# EasyEDA schematic 1-Schematic_SillyILO-0.0.1.json
TITLE: Sheet_1; REV: 1.0; Date: 2021-01-09; Sheet: 1/1; Drawn By: yaleman; Company: Your Company
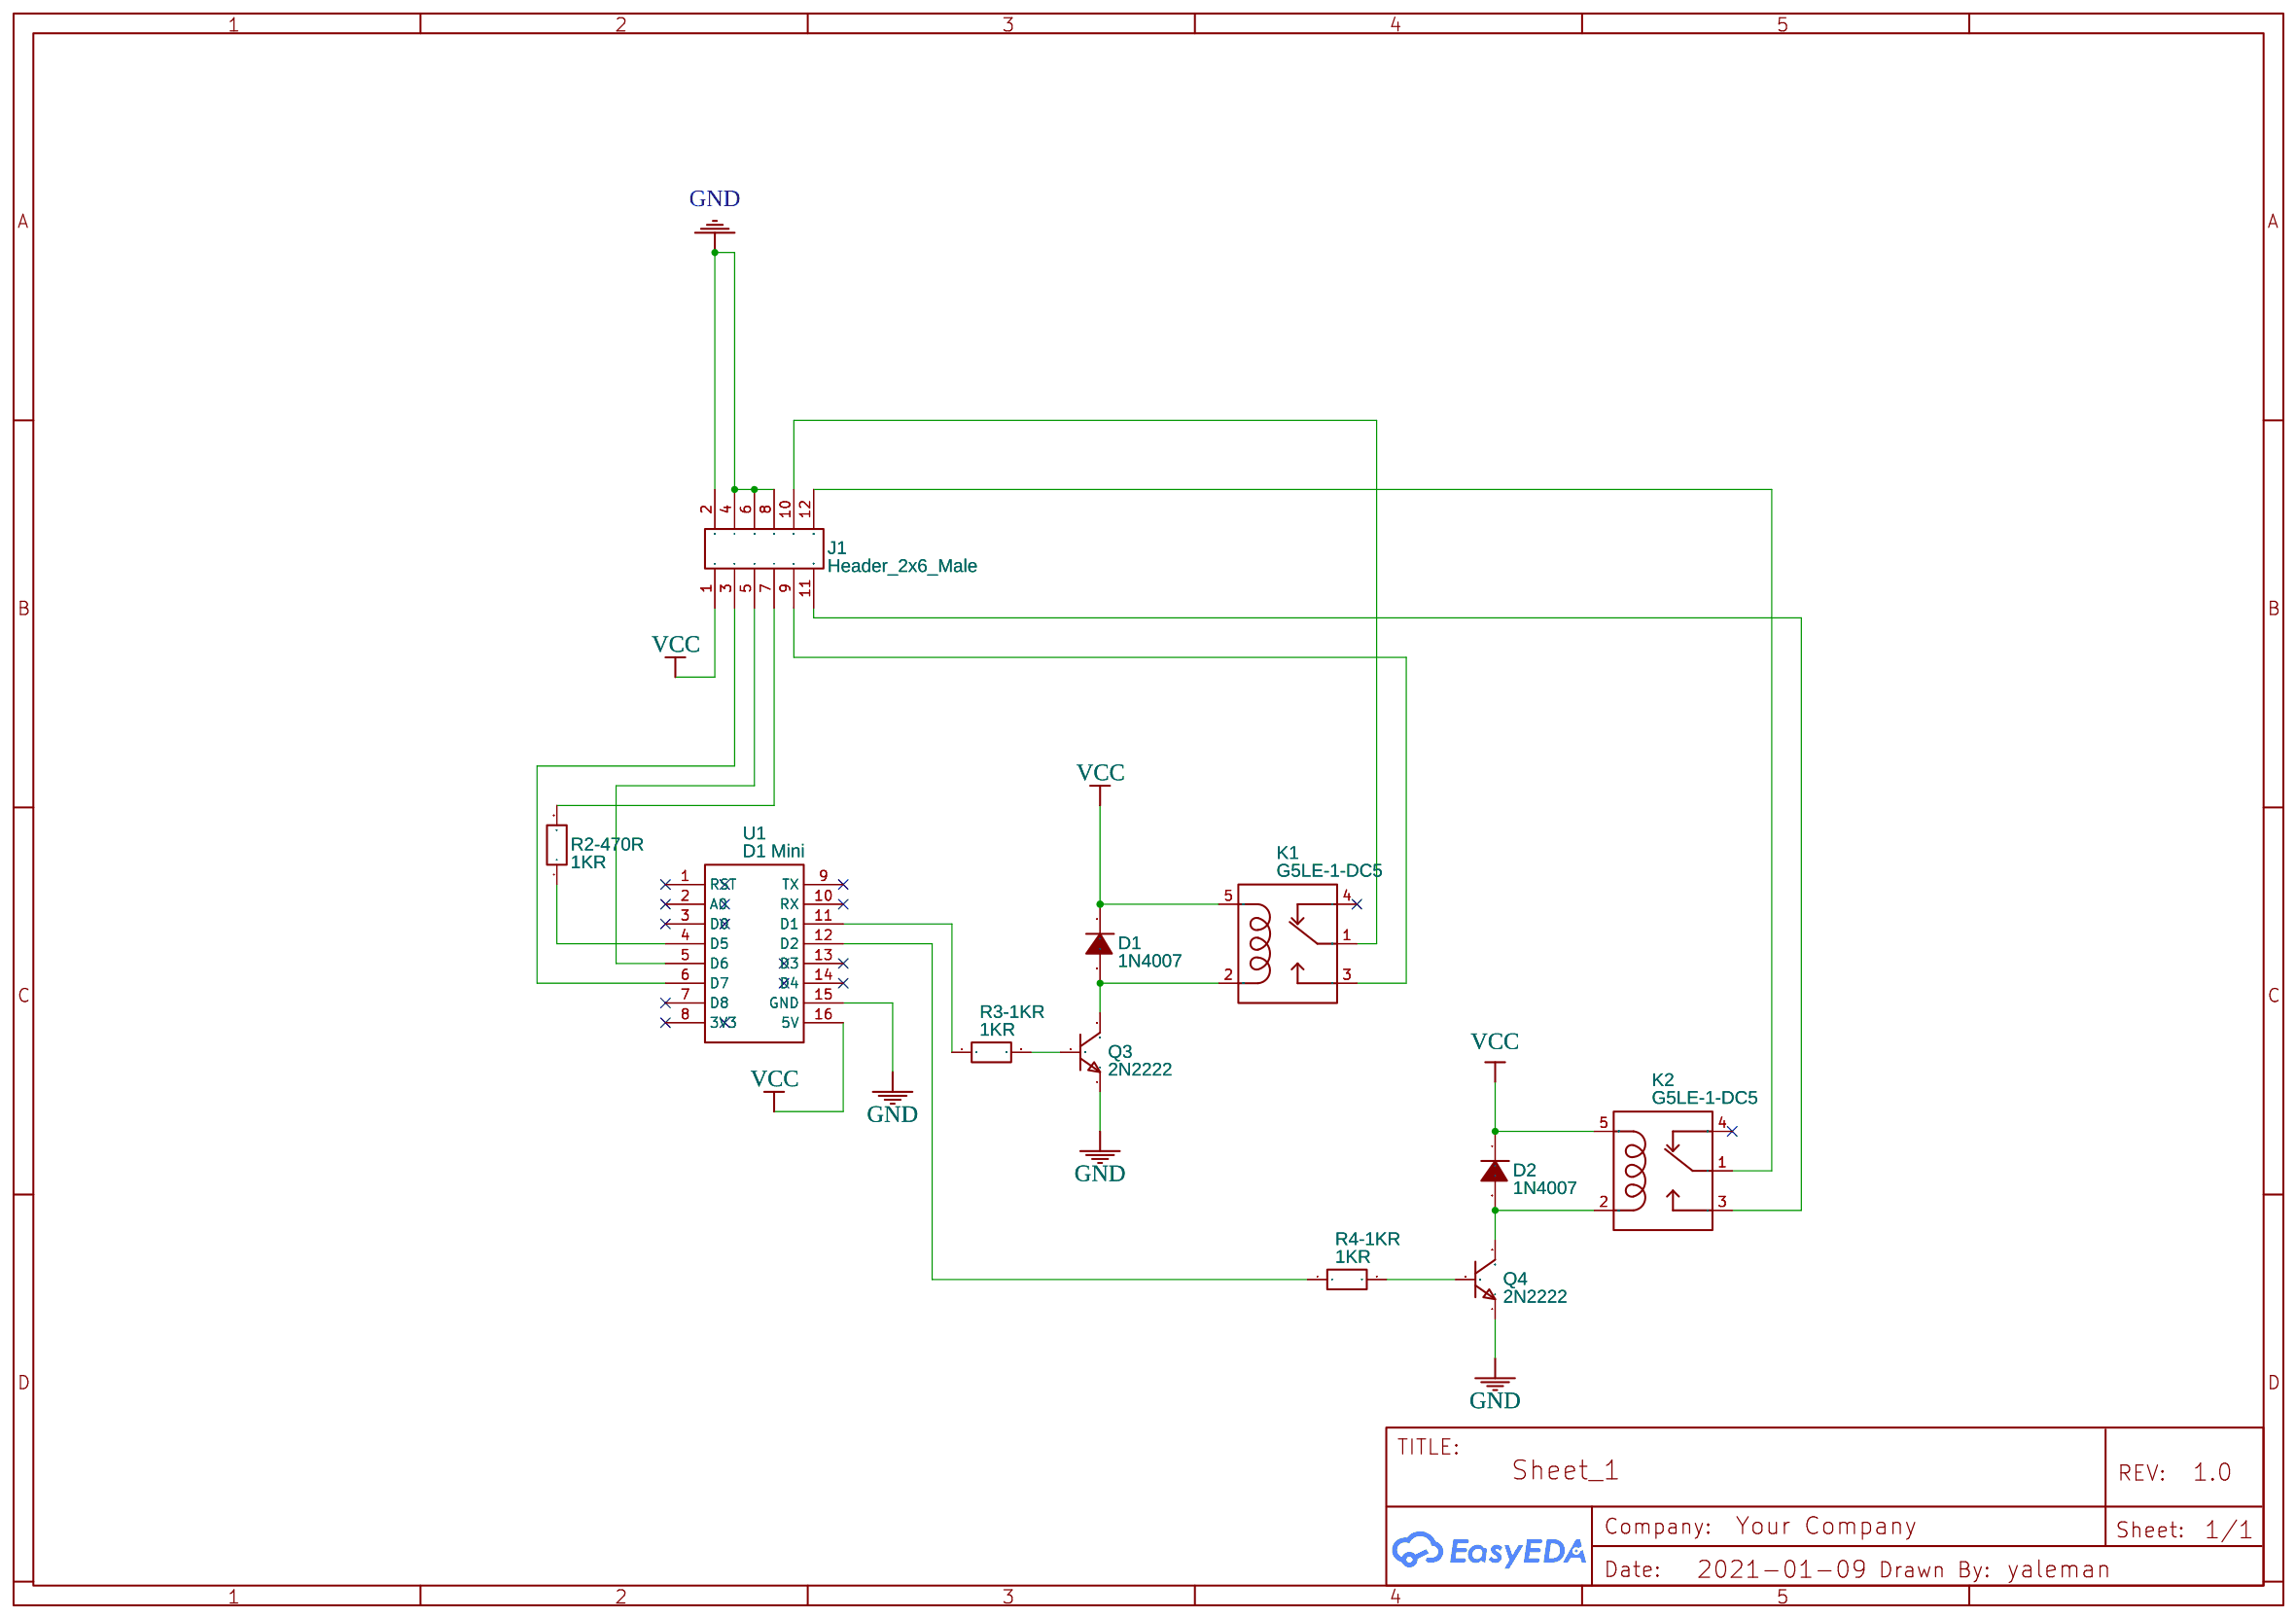
[diagram p0: schematic sheet]

## Parts
D1  1N4007  [DO-41_BD2.4-L4.7-P8.70-D0.9-RD]
D2  1N4007  [DO-41_BD2.4-L4.7-P8.70-D0.9-RD]
J1  Header_2x6_Male  [2X6_2.54MM_HEADER]
K1  G5LE-1-DC5  [RELAY-TH_G5LE-1-XX]
K2  G5LE-1-DC5  [RELAY-TH_G5LE-1-XX]
Q3  2N2222  [TO-92-3_L4.9-W3.7-P1.27-L]
Q4  2N2222  [TO-92-3_L4.9-W3.7-P1.27-L]
R2-470R  1KR  [RESISTOR AXIAL 14.5X4]
R3-1KR  1KR  [RESISTOR AXIAL 14.5X4]
R4-1KR  1KR  [RESISTOR AXIAL 14.5X4]
U1  D1 Mini  [D1 MINI]

## Library data of the parts
D1 D2 = 1N4007: Supplier: LCSC; Manufacturer: SEMTECH; Supplier Part: C106903; LCSC Assembly: Yes; SMT Type: Extend
J1 = Header_2x6_Male: Contributor: kegler; sourceId: HEyQK2kew
K1 K2 = G5LE-1-DC5: Supplier: LCSC; Supplier Part: C152704; Manufacturer: Omron Electronics; Contributor: LCSC; LCSC Assembly: Yes; SMT Type: Extend
Q3 Q4 = 2N2222: Supplier: LCSC; Manufacturer: SEMTECH; Contributor: LCSC; Supplier Part: C118536; LCSC Assembly: Yes; SMT Type: Extend
R2-470R R3-1KR R4-1KR = 1KR: Manufacturer: KOA Speer; Manufacturer Part: MF1/4DCT26A1001F; Supplier: Mouser; Supplier Part: 660-MF1/4DCT26A1001F; link: https://th.mouser.com/datasheet/2/219/MF-MFS-RK-18760.pdf; Contributor: Wichai Tungwachirakul
U1 = D1 Mini: Contributor: jinakola

## Nets
GND: J1.2 J1.4 J1.6 J1.8 Q3.1(E) Q4.1(E) U1.15(GND)
VCC: D1.1(K) D2.1(K) J1.1 K1.5(COIL1) K2.5(COIL1) U1.16(5V)
Net-(D1-2): D1.2(A) K1.2(COIL2) Q3.3(C)
Net-(D2-2): D2.2(A) K2.2(COIL2) Q4.3(C)
Net-(J1-3): J1.3 U1.6(D7)
Net-(J1-5): J1.5 U1.5(D6)
Net-(J1-7): J1.7 R2-470R.2
Net-(J1-9): J1.9 K1.3(NO)
Net-(J1-10): J1.10 K1.1(C)
Net-(J1-11): J1.11 K2.3(NO)
Net-(J1-12): J1.12 K2.1(C)
Net-(Q3-2): Q3.2(B) R3-1KR.2
Net-(Q4-2): Q4.2(B) R4-1KR.2
Net-(R2-470R-1): R2-470R.1 U1.4(D5)
Net-(R3-1KR-1): R3-1KR.1 U1.11(D1)
Net-(R4-1KR-1): R4-1KR.1 U1.12(D2)

Not connected (* = marked no-connect by the designer): K1 4(NC)*; K2 4(NC)*; U1 1(RST)* 2(A0)* 3(D0)* 7(D8)* 8(3V3)* 9(TX)* 10(RX)* 13(D3)* 14(D4)*
